# Altium schematic sheet Step_ACS712.SchDoc: Mạch điều khiển trên Robot
size A4; Date: *11/11/2020; Time: *aa
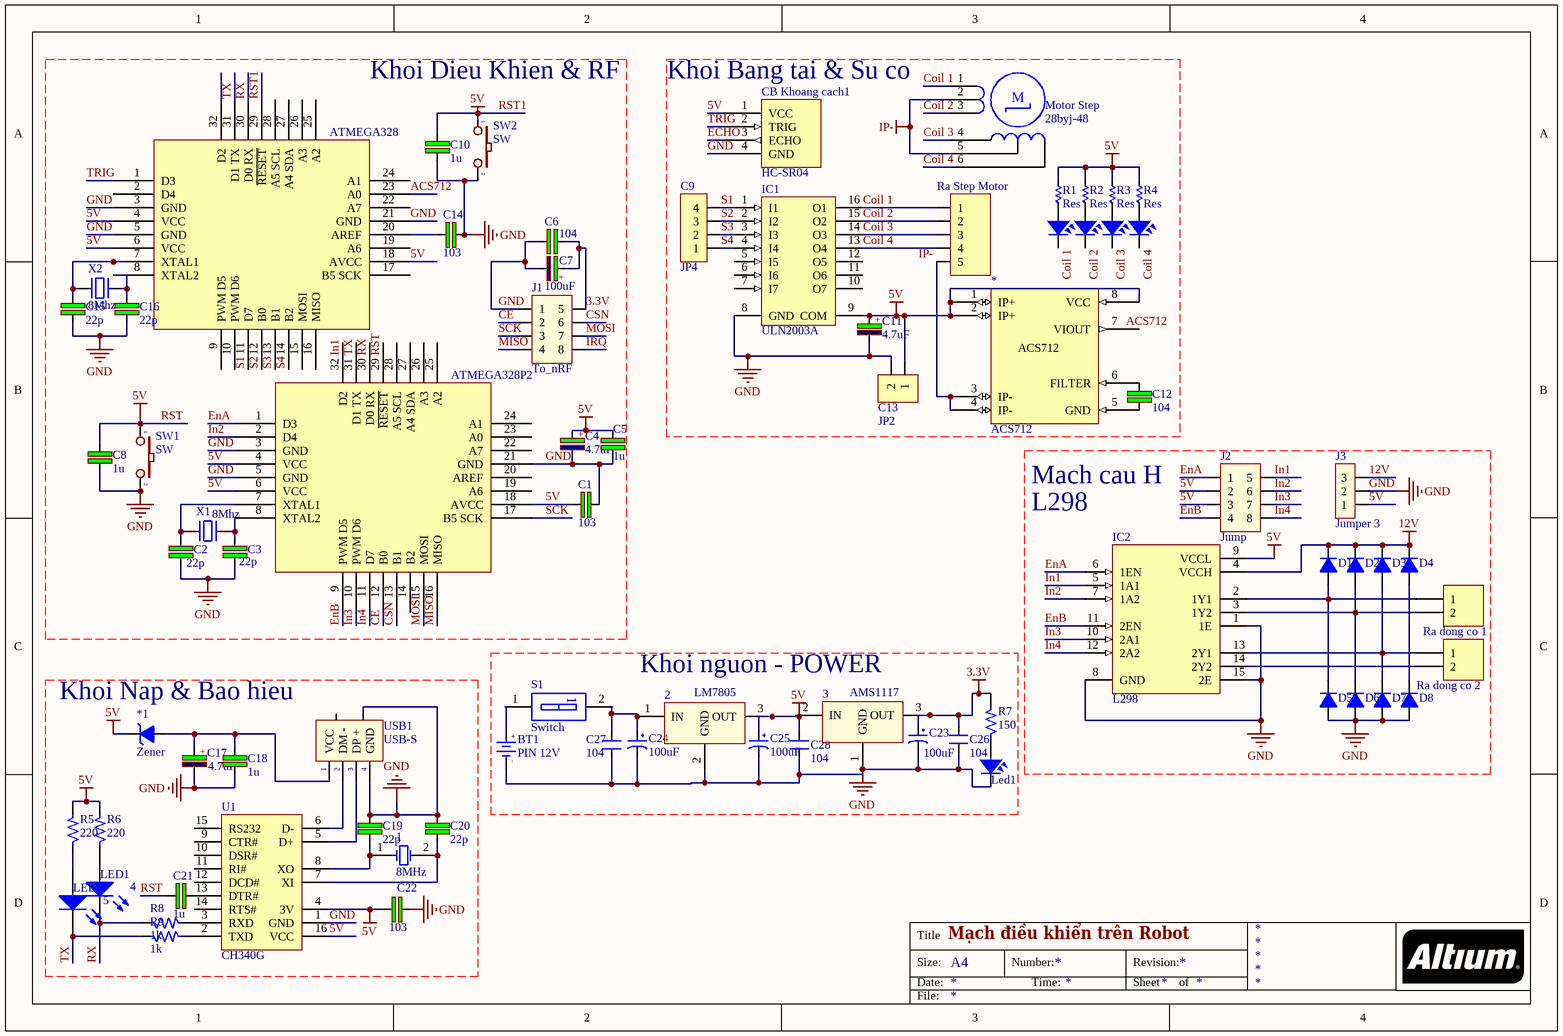
[diagram p0: Step_ACS712.SchDoc]

## Parts
(Parts that share a designator on the sheet are numbered #1, #2 ... from top to bottom, then left to right.)
1  8MHz  [R38]
2  LM7805  [QTO-220]
3  AMS1117  [QTO-220]
4  LED1  [3.5X2.8X1.9]
5  LED  [3.5X2.8X1.9]
28byj-48  Motor Step  [HDR6]
*  ACS712  [SOIC8]
*1  Zener  [D1A]
?#1  LED  [LED-3MM-YELLOW]  (value not drawn)
?#2  LED  [LED-3MM-YELLOW]  (value not drawn)
?#3  LED  [LED-3MM-YELLOW]  (value not drawn)
?#4  LED  [LED-3MM-YELLOW]  (value not drawn)
?#5  ATMEGA328  [TQFP80P900X900X120-32N]
?#6  ATMEGA328P2  [TQFP80P900X900X120-32N]
BT1  PIN 12V  [PIN3V]
C1  103  [C-0805]
C2  22p  [C-0805]
C3  22p  [C-0805]
C4  4.7uF  [10uF/10V]
C5  1u  [CN1.5]
C6  104  [CN1.5]
C7  100uF  [10uF/10V]
C8  1u  [CN1.5]
C9  JP4  [JP4-C1T]
C10  1u  [CN1.5]
C11  4.7uF  [10uF/10V]
C12  104  [CN1.5]
C13  JP2  [JP2-C1T]
C14  103  [C-0805]
C15  22p  [C-0805]
C16  22p  [C-0805]
C17  4.7uF  [CP4.5/19]
C18  1u  [CN3]
C19  22p  [CN3]
C20  22p  [CN3]
C21  1u  [CN3]
C22  103  [CN3]
C23  100uF  [CP1.5/3.4]
C24  100uF  [CP1.5/3.4]
C25  100uF  [CP1.5/3.4]
C26  104  [CN2]
C27  104  [CN2]
C28  104  [CN2]
CB_Khoang_cach1  HC-SR04  [HC-SR04]
D1  (no value)  [D1A]
D2  (no value)  [D1A]
D3  (no value)  [D1A]
D4  (no value)  [D1A]
D5  (no value)  [D1A]
D6  (no value)  [D1A]
D7  (no value)  [D1A]
D8  (no value)  [D1A]
IC1  ULN2003A  [SO-G16/X.6]
IC2  L298  [DIP15SL2]
J1  To_nRF  [JP4x2]
J2  Jump  [JP4x2]
J3  Jumper 3  [JP3]
Led1  LED SMD  [SM-LED-0805-Blue]  (value not drawn)
R1  Res  [RES-1/2W]
R2  Res  [RES-1/2W]
R3  Res  [RES-1/2W]
R4  Res  [RES-1/2W]
R5  220  [SM-1206]
R6  220  [SM-1206]
R7  150  [SM-RES-1206]
R8  1k  [SM-1206]
R9  1k  [SM-1206]
Ra_dong_co_1  Header 2  [JP2]  (value not drawn)
Ra_dong_co_2  Header 2  [JP2]  (value not drawn)
Ra_Step_Motor  (no value)  [JP5-C1T]
S1  Switch  [DIP-4]
SW1  SW  [BUTTON 2PIN TRON]
SW2  SW  [BUTTON 2PIN TRON]
U1  CH340G  [SO16]
USB1  USB-S  [USB-S1]
X1  8Mhz  [XT2]
X2  8Mhz  [XT2]

## Nets
3.3V: 3.3(OUT) C6.1 C7.1 C23.1 C26.2 J1.5 R7.2
5V: 2.3(OUT) 3.2(IN) *.1(IP+) *.2(IP+) *.8(VCC) *1.2(K) ?#5.4(VCC) ?#5.6(VCC) ?#5.18(AVCC) ?#5.29(~{RESET}) ?#6.4(VCC) ?#6.6(VCC) ?#6.18(AVCC) C1.2 C4.1 C5.2 C8.2 C10.2 C11.1 C13.1 C21.2 C22.1 C25.1 C28.2 CB_Khoang_cach1.1(VCC) IC1.9(COM) IC2.9(VCCL) J2.2 J2.3 J3.1 R1.1 R2.1 R3.1 R4.1 R5.2 R6.2 SW1.1 SW2.1 U1.4(3V) U1.16(VCC)  [also labelled RST, RST1]
12V: D1.2(K) D2.2(K) D3.2(K) D4.2(K) IC2.4(VCCH) J3.3
GND: 2.2(GND) 3.1(GND) ?#5.3(GND) ?#5.5(GND) ?#5.21(GND) ?#6.3(GND) ?#6.5(GND) ?#6.21(GND) BT1.2(GND) C1.1 C2.1 C3.1 C4.2 C5.1 C6.2 C7.2 C8.1 C10.1 C11.2 C13.2 C14.1 C15.1 C16.1 C17.2 C18.1 C19.2 C20.2 C22.2 C23.2 C24.2 C25.2 C26.1 C27.1 C28.1 CB_Khoang_cach1.4(GND) D5.1(A) D6.1(A) D7.1(A) D8.1(A) IC1.8(GND) IC2.1(1E) IC2.8(GND) IC2.15(2E) J1.1 J3.2 Led1.2 SW1.2 SW2.2 U1.1(GND) USB1.4(GND) USB1.6
IP-: 28byj-48.2 28byj-48.5
ACS712: ?#5.23(A0)
CE: ?#6.12(B0) J1.2
Coil 1: 28byj-48.1(1A) ?#1.2 IC1.16(O1) Ra_Step_Motor.1
Coil 2: 28byj-48.3 ?#2.2 IC1.15(O2) Ra_Step_Motor.2
Coil 3: 28byj-48.4 ?#3.2 IC1.14(O3) Ra_Step_Motor.3
Coil 4: 28byj-48.6 ?#4.2 IC1.13(O4) Ra_Step_Motor.4
CSN: ?#6.13(B1) J1.6
ECHO: CB_Khoang_cach1.3(ECHO)
EnA: ?#6.1(D3) IC2.6(1EN) J2.1
EnB: ?#6.9(PWM_D5) IC2.11(2EN) J2.4
In1: IC2.5(1A1) J2.5
In2: ?#6.2(D4) IC2.7(1A2) J2.6
In3: ?#6.10(PWM_D6) IC2.10(2A1) J2.7
In4: ?#6.11(D7) IC2.12(2A2) J2.8
IRQ: J1.8
MISO: ?#6.16(MISO) J1.4
MOSI: ?#6.15(MOSI) J1.7
RX: 4.2(K) ?#5.30(D0_RX) R8.1
S1: ?#5.11(D7) C9.4 IC1.1(I1)
S2: ?#5.12(B0) C9.3 IC1.2(I2)
S3: ?#5.13(B1) C9.2 IC1.3(I3)
S4: ?#5.14(B2) C9.1 IC1.4(I4)
SCK: ?#6.17(B5_SCK) J1.3
TRIG: ?#5.1(D3) CB_Khoang_cach1.2(TRIG)
TX: 5.2(K) ?#5.31(D1_TX) R9.1
Net1_1: 1.1(OSC1) C19.1 U1.8(XO)
Net1_2: 1.2(OSC2) C20.1 U1.7(XI)
Net2_1: 2.1(IN) C24.1 C27.2 S1.2(A2)
Net4_1: 4.1(A) R6.1
Net5_1: 5.1(A) R5.1
Net*1_1: *1.1(A) C17.1 C18.2 USB1.1(VCC)
Net*_3: *.3(IP-) *.4(IP-) Ra_Step_Motor.5
Net*_5: *.5(GND) C12.2
Net*_6: *.6(FILTER) C12.1
Net?#1_1: ?#1.1 R1.2
Net?#2_1: ?#2.1 R2.2
Net?#3_1: ?#3.1 R3.2
Net?#4_1: ?#4.1 R4.2
Net?#5_7: ?#5.7(XTAL1) C15.2 X2.2
Net?#5_8: ?#5.8(XTAL2) C16.2 X2.1
Net?#5_20: ?#5.20(AREF) C14.2
Net?#6_7: ?#6.7(XTAL1) C2.2 X1.2
Net?#6_8: ?#6.8(XTAL2) C3.2 X1.1
NetBT1_1: BT1.1(+3V) S1.1(A1)
NetC21_1: C21.1 U1.13(DTR#)
NetD1_1: D1.1(A) D5.2(K) IC2.2(1Y1) Ra_dong_co_1.1
NetD2_1: D2.1(A) D6.2(K) IC2.3(1Y2) Ra_dong_co_1.2
NetD3_1: D3.1(A) D7.2(K) IC2.13(2Y1) Ra_dong_co_2.1
NetD4_1: D4.1(A) D8.2(K)
NetIC2_14: IC2.14(2Y2) Ra_dong_co_2.2
NetLed1_1: Led1.1 R7.1
NetR8_2: R8.2 U1.3(RXD)
NetR9_2: R9.2 U1.2(TXD)
NetU1_5: U1.5(D+) USB1.3(DP_+)
NetU1_6: U1.6(D-) USB1.2(DM_-)

Not connected (* = marked no-connect by the designer): * 7(VIOUT); ?#5 2(D4) 9(PWM_D5) 10(PWM_D6) 15(MOSI) 16(MISO) 17(B5_SCK) 19(A6) 22(A7) 24(A1) 25(A2) 26(A3) 27(A4_SDA) 28(A5_SCL) 32(D2); ?#6 14(B2) 19(A6) 20(AREF) 22(A7) 23(A0) 24(A1) 25(A2) 26(A3) 27(A4_SDA) 28(A5_SCL) 29(~{RESET}) 30(D0_RX) 31(D1_TX) 32(D2); IC1 5(I5) 6(I6) 7(I7) 10(O7) 11(O6) 12(O5); U1 9(CTR#) 10(DSR#) 11(RI#) 12(DCD#) 14(RTS#) 15(RS232); USB1 5

## Notes on the sheet
- Khoi Dieu Khien & RF
- Khoi Bang tai & Su co
- Mach cau H
- (near IC2) L298
- Khoi Nap & Bao hieu
- Khoi nguon - POWER
- Labels drawn without touching a wire or pin: ACS712, In1, IP-, RST, RX, TX
- Title
- Size:
- Date:
- A4
- Number:
- Time:
- Revision:
- Sheet
- of
- File:
- (in symbol CP0_1) +
- (in symbol CP9) +
- (in symbol Motor Step) M
- (in symbol PIN 3V) +; -

## Library data of the parts
1 = XTAL: Crystal Oscillator; Published: 8-Jun-2000; LatestRevisionDate: 17-Jul-2002; LatestRevisionNote: Re-released for DXP Platform.; PackageReference: R38; Publisher: Altium Limited; PackageDescription: Crystal, Thru-Hole; 2 Leads; Body 3.1 x 8.2 mm (Dia.xH)
2 = LM78xx: On ap +, from + 5 to + 24VDC; Value: LM7805
3 = LM79xx: On ap -, from - 5 to - 24VDC; Value: LM7905
4 5 = LED3: Typical BLUE SiC LED; Published: 8-Jun-2000; LatestRevisionDate: 17-Dec-2003; LatestRevisionNote: PCB Footprint replaced.; DatasheetVersion: 16-Apr-2002; PackageVersion: 16-Apr-2002; PackageReference: 3.5X2.8X1.9; Publisher: Altium Limited; PackageDescription: SM LED; 2 C-Bend Leads; Body 3.5 x 2.8 x 1.9 mm, inc leads (LxWxH typ)
28byj-48 = Motor Step: Motor Stepper; Published: 24-Mar-1999; LatestRevisionDate: 17-Jul-2002; LatestRevisionNote: Re-released for DXP Platform.; PackageReference: DIP-6; Publisher: Altium Limited; Code_JEDEC: MO-001-AM
*1 = Zener: DIOT ZENER
?#1-?#4 = LED: LED Single colour Green and Red; Value: LED 3 ly Single Colour
?#5 ?#6 = ATMEGA328P-AU: Microchip Technology ATMEGA328P-AN, 8bit AVR Microcontroller, 20MHz, 32 kB Flash, 32-Pin TQFP
BT1 = PIN 3V: Battery 3VDC; Value: PIN 3V
C1 C14 = C: Cap SMD; Value: 103
C2 C3 C15 C16 = C: Cap SMD; Value: 103
C4 C7 C11 = CP0_1: Cap P  0,1uF < 22uF , 16 - 50V; Value: 10uF/50V; Description 1: 10 => 220uF/6,3V/10V - 10uF => 100uF/16V; Description 2: 0,1uF => 33uF/50V - 10uF => 22uF/63V; Description 3: 0,47uF => 10uF/100V
C5 C6 C8 C10 C12 = CN1.5: Cap np 682pF => 104pF; Value: 0.01uF
C9 = JP4: WR-PHD 2.54 mm Angled Socket Header; Manufacturer: W¨¹rth Elektronik eiSos GmbH; partNo: 613004143121; ComponentLink1 Description: Manufacturer; ComponentLink2 Description: Datasheet; NoPins: 04; Created Date: 29 March 2013; ComponentLink1URL: http://www.we-online.com; ComponentLink2URL: http://katalog.we-online.de/em/datasheet/6130xx143121.pdf; Created by: Karrer Zheng
C13 = JP2: WR-PHD 2.54 mm Angled Socket Header; Manufacturer: W¨¹rth Elektronik eiSos GmbH; partNo: 613002143121; ComponentLink1 Description: Manufacturer; ComponentLink2 Description: Datasheet; NoPins: 02; Created Date: 29 March 2013; ComponentLink1URL: http://www.we-online.com; ComponentLink2URL: http://katalog.we-online.de/em/datasheet/6130xx143121.pdf; Created by: Karrer Zheng
C17 = CP9: Cap 10000uF/63V; Value: 220uF/450V
C18-C22 = CN3: Cap np W0.3; Value: 0,047uF; Copyright: VanDungEvn
C23-C25 = CP3: Cap 100uF/35V - 470uF/16V; Value: 100uF/35V/50V; Description 1: 1000uF/6,3V - 470uF/16V - 330uF - 25V; Description 2: 220uF/35V - 100uF/50V - 63V - 4,7uF/200V; Description 3: 22uF => 33uF100V - 3,3uF => 4,7uF/250V; Description 4: 2,2uF =>3,3uF/350 - 2,2uF/400V - 1uF/450V
C26-C28 = CN2: Cap np 104 => 105pF; Value: 0.1uF
D1-D8 = D1A: Diode 1A; Value: 1N4007
IC1 = ULN2003A: High-Voltage, High-Current Darlington Array; LatestRevisionNote: Stylized 3D Model Added.; Publisher: Altium Limited; Value: ULN2003A
IC2 = L298: Dual Full-H Driver; Note: The tab is elec is connected to GND pin; Published: 15-May-2002; DatasheetVersion: Jun-1990; PackageReference: KV015; Publisher: Altium Limited; PackageDescription: TO, Thru-Hole, Vertical, Heatsink Mounted; 15 Bent Staggered Leads; Pitch 1.27 mm; ComponentLink1Description: Manufacturer Link; ComponentLink1URL: http://www.ti.com/
J1 J2 = JP4x2: Connector 4x2; Value: Connector 4x2
J3 = JP3: Value: J3
Led1 = LED-SMD-0805
R1-R4 = Res: Manufacturer: Generic Components; Class: Passive; SubClass: R; Published: 08/06/2000; Publisher: Altium Hobart Technology Centre
R5-R9 = R: Resistor 1/4W; Value: R1/4W - 1K
Ra_dong_co_1 Ra_dong_co_2 = Header 2: Header, 2-Pin; LatestRevisionDate: 17-Jul-2002; LatestRevisionNote: Re-released for DXP Platform.; Publisher: Altium Limited
Ra_Step_Motor = JP5: WR-PHD 2.54 mm Angled Socket Header; Manufacturer: W¨¹rth Elektronik eiSos GmbH; partNo: 613005143121; ComponentLink1 Description: Manufacturer; ComponentLink2 Description: Datasheet; NoPins: 05; Created Date: 29 March 2013; ComponentLink1URL: http://www.we-online.com; ComponentLink2URL: http://katalog.we-online.de/em/datasheet/6130xx143121.pdf; Created by: Karrer Zheng
S1 = SW DIP-1: DIP Switch, 2 Position, SPST; Published: 24-Mar-1999; LatestRevisionDate: 17-Jul-2002; LatestRevisionNote: Re-released for DXP Platform.; PackageReference: DIP-4; Publisher: Altium Limited
SW1 SW2 = SW2: Switch button 2 pin; Value: SW chip 2 pin
U1 = CH340G: High and Low Side Driver; Note: Pins 4, 8 and 14 are not connected; Published: 8-Jun-2000; LatestRevisionDate: 04-Mar-2005; LatestRevisionNote: Stylized 3D Model Added.; DatasheetVersion: PD60147J; PackageReference: PDIP14; Publisher: Altium Limited; PackageDescription: DIP; 14 Leads; Row Spacing 7.62 mm; Pitch 2.54 mm; ComponentLink1Description: Manufacturer Link; ComponentLink1URL: http://www.irf.com/; ComponentLink2Description: Datasheet; ComponentLink2URL: http://www.irf.com/product-info/datasheets/data/ir2110.pdf
USB1 = USB_S: USB connector; Value: USB
X1 X2 = XT2: Crystal For all Crystal 2pin.; Value: 4Mhz
CB_Khoang_cach1 = HC-SR04: TECHMT.VN: TECHMT.VN